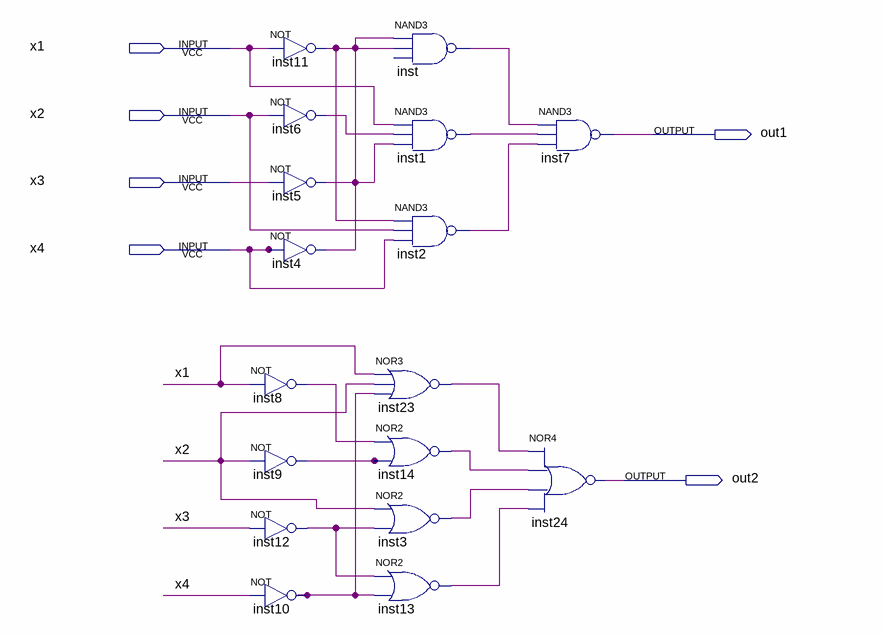
[diagram p0: schematic sheet]
// Quartus schematic lab01.bdf as structural Verilog: 17 symbols, 6 pins
module lab01 (
  input  x1,
  input  x2,
  input  x3,
  input  x4,
  output out1,
  output out2
);

  wire inst1_out, inst2_out, inst3_out, inst6_out, inst8_out, inst9_out, inst10_out, inst11_out, inst12_out,
       inst13_out, inst14_out, inst23_out, inst_out;

  not inst11 (inst11_out, x1);
  not inst6 (inst6_out, x2);
  not inst5 (inst11_out, x3);
  not inst4 (inst11_out, x4);
  not inst8 (inst8_out, x1);
  not inst9 (inst9_out, x2);
  not inst12 (inst12_out, x3);
  not inst10 (inst10_out, x4);
  nor inst23 (inst23_out, x1, x2, inst10_out);
  nor inst14 (inst14_out, inst8_out, inst9_out);
  nor inst3 (inst3_out, x2, inst12_out);
  nor inst13 (inst13_out, inst12_out, inst10_out);
  nand inst (inst_out, inst11_out, inst11_out);  // open: IN3
  nand inst1 (inst1_out, x1, inst6_out, inst11_out);
  nand inst2 (inst2_out, inst11_out, x2, x4);
  nand inst7 (out1, inst_out, inst1_out, inst2_out);
  nor inst24 (out2, inst23_out, inst14_out, inst3_out, inst13_out);
endmodule
